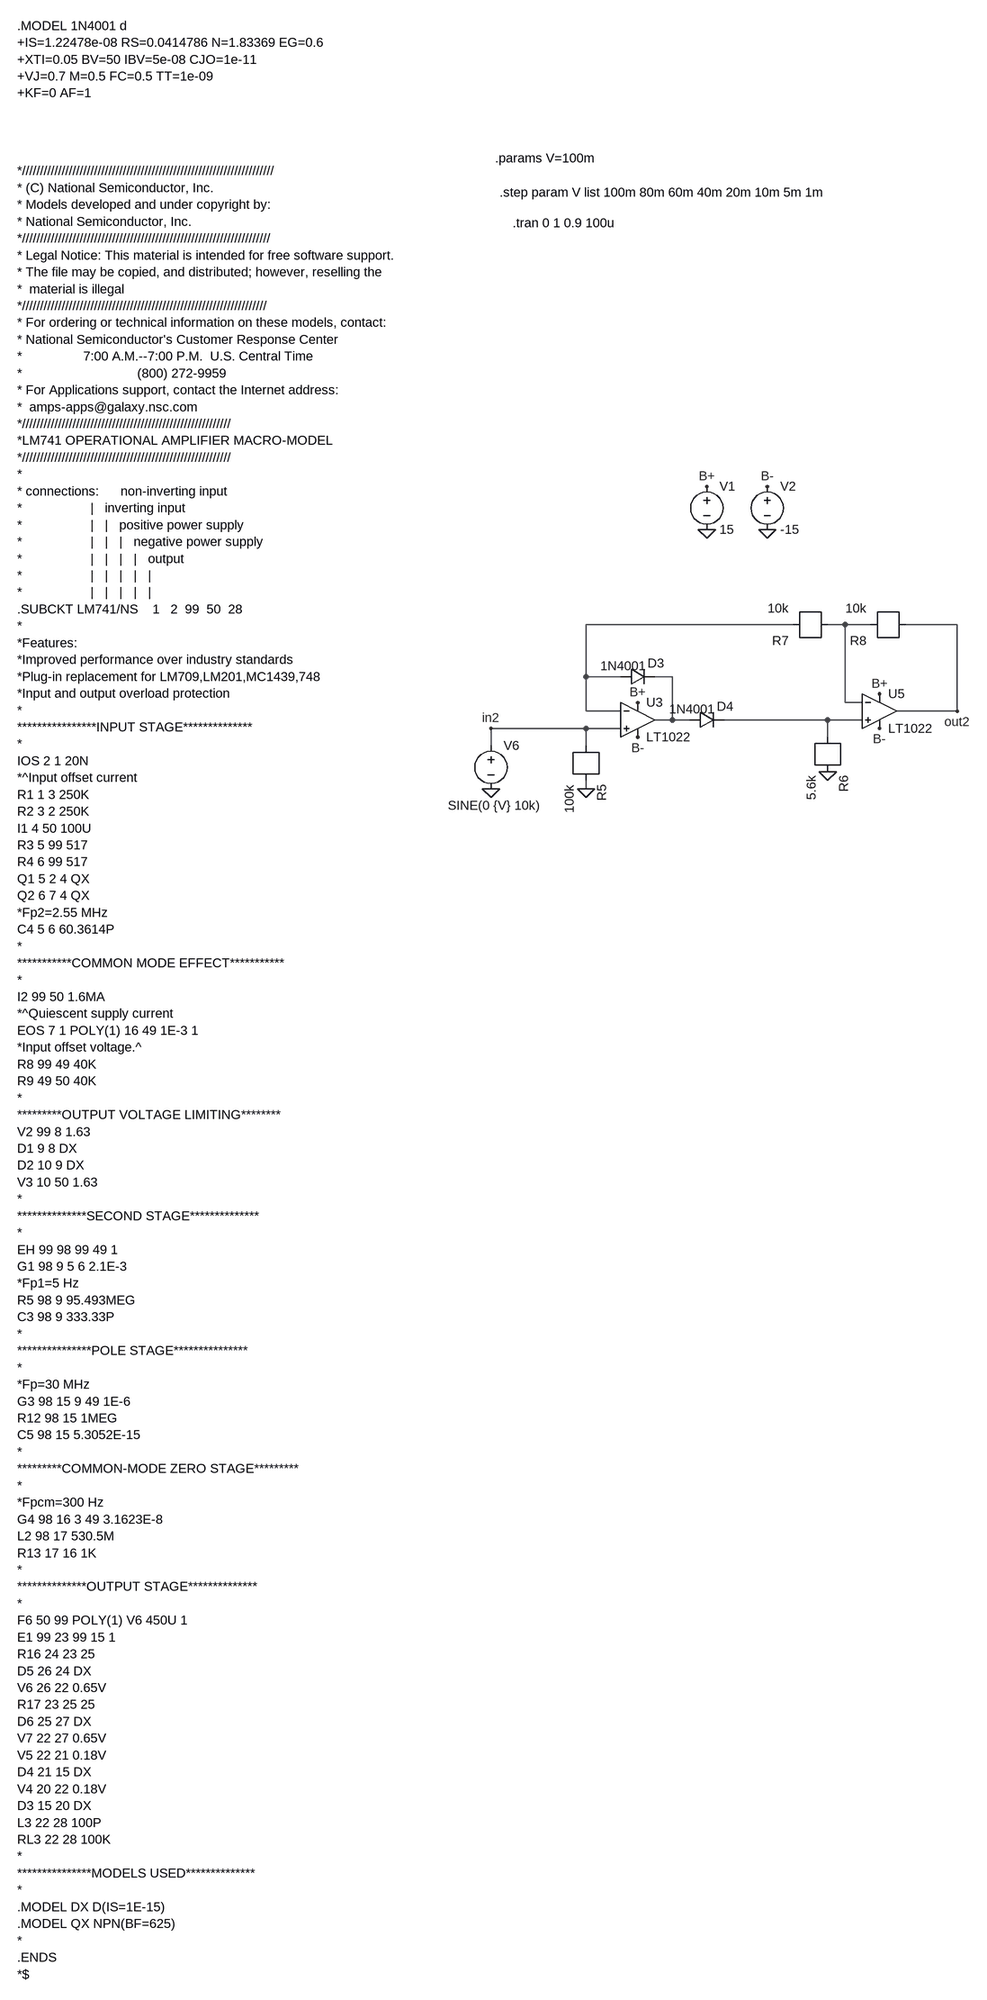
[diagram p0: schematic instru3.1.asc]
instru3.1.asc, the LTspice schematic file:
Version 4
SHEET 1 1272 2296
WIRE 480 768 96 768
WIRE 576 768 544 768
WIRE 624 768 576 768
WIRE 784 768 688 768
WIRE 96 864 96 768
WIRE 160 864 96 864
WIRE 256 864 224 864
WIRE 576 912 576 768
WIRE 608 912 576 912
WIRE 96 928 96 864
WIRE 160 928 96 928
WIRE 784 928 784 768
WIRE 784 928 672 928
WIRE 256 944 256 864
WIRE 256 944 224 944
WIRE 288 944 256 944
WIRE 544 944 352 944
WIRE 608 944 544 944
WIRE 96 960 -80 960
WIRE 160 960 96 960
WIRE 544 976 544 944
WIRE -80 992 -80 960
WIRE 96 992 96 960
WIRE 96 1072 96 1056
FLAG 432 592 0
FLAG 320 592 0
FLAG 320 512 B+
FLAG 432 512 B-
FLAG 544 1040 0
FLAG 192 912 B+
FLAG 640 896 B+
FLAG 640 960 B-
FLAG 192 976 B-
FLAG 784 928 out2
FLAG -80 960 in2
FLAG -80 1072 0
FLAG 96 1072 0
SYMBOL voltage 320 496 R0
SYMATTR InstName V1
SYMATTR Value 15
SYMBOL voltage 432 496 R0
SYMATTR InstName V2
SYMATTR Value -15
SYMBOL r 96 992 R90
SYMATTR InstName R5
SYMATTR Value 100k
SYMBOL r 544 976 R90
SYMATTR InstName R6
SYMATTR Value 5.6k
SYMBOL r 544 768 R180
SYMATTR InstName R7
SYMATTR Value 10k
SYMBOL r 688 768 R180
SYMATTR InstName R8
SYMATTR Value 10k
SYMBOL voltage -80 976 R0
WINDOW 3 -80 127 Left 2
SYMATTR Value SINE(0 {V} 10k)
SYMATTR InstName V6
SYMBOL diode 160 880 R270
WINDOW 0 25 66 VTop 2
WINDOW 3 51 5 VBottom 2
SYMATTR InstName D3
SYMATTR Value 1N4001
SYMBOL diode 288 960 R270
WINDOW 0 25 66 VTop 2
WINDOW 3 51 5 VBottom 2
SYMATTR InstName D4
SYMATTR Value 1N4001
SYMBOL opamps/LT1022 640 864 R0
SYMATTR InstName U5
SYMBOL opamps/LT1022 192 880 R0
SYMATTR InstName U3
TEXT -1848 -376 Left 2 !.MODEL 1N4001 d\n+IS=1.22478e-08 RS=0.0414786 N=1.83369 EG=0.6\n+XTI=0.05 BV=50 IBV=5e-08 CJO=1e-11\n+VJ=0.7 M=0.5 FC=0.5 TT=1e-09\n+KF=0 AF=1
TEXT -1848 -72 Left 2 !*//////////////////////////////////////////////////////////////////////\n* (C) National Semiconductor, Inc.\n* Models developed and under copyright by:\n* National Semiconductor, Inc.  \n*/////////////////////////////////////////////////////////////////////\n* Legal Notice: This material is intended for free software support.\n* The file may be copied, and distributed; however, reselling the \n*  material is illegal\n*////////////////////////////////////////////////////////////////////\n* For ordering or technical information on these models, contact:\n* National Semiconductor's Customer Response Center\n*                 7:00 A.M.--7:00 P.M.  U.S. Central Time\n*                                (800) 272-9959\n* For Applications support, contact the Internet address:\n*  amps-apps@galaxy.nsc.com\n*//////////////////////////////////////////////////////////\n*LM741 OPERATIONAL AMPLIFIER MACRO-MODEL\n*//////////////////////////////////////////////////////////\n*\n* connections:      non-inverting input\n*                   |   inverting input\n*                   |   |   positive power supply\n*                   |   |   |   negative power supply\n*                   |   |   |   |   output\n*                   |   |   |   |   |\n*                   |   |   |   |   |\n.SUBCKT LM741/NS    1   2  99  50  28\n*\n*Features:\n*Improved performance over industry standards\n*Plug-in replacement for LM709,LM201,MC1439,748\n*Input and output overload protection\n*\n****************INPUT STAGE**************\n*\nIOS 2 1 20N\n*^Input offset current\nR1 1 3 250K\nR2 3 2 250K\nI1 4 50 100U\nR3 5 99 517\nR4 6 99 517\nQ1 5 2 4 QX\nQ2 6 7 4 QX\n*Fp2=2.55 MHz\nC4 5 6 60.3614P\n*\n***********COMMON MODE EFFECT***********\n*\nI2 99 50 1.6MA\n*^Quiescent supply current\nEOS 7 1 POLY(1) 16 49 1E-3 1\n*Input offset voltage.^\nR8 99 49 40K\nR9 49 50 40K\n*\n*********OUTPUT VOLTAGE LIMITING********\nV2 99 8 1.63\nD1 9 8 DX\nD2 10 9 DX\nV3 10 50 1.63\n*\n**************SECOND STAGE**************\n*\nEH 99 98 99 49 1\nG1 98 9 5 6 2.1E-3\n*Fp1=5 Hz\nR5 98 9 95.493MEG\nC3 98 9 333.33P\n*\n***************POLE STAGE***************\n*\n*Fp=30 MHz\nG3 98 15 9 49 1E-6\nR12 98 15 1MEG\nC5 98 15 5.3052E-15\n*\n*********COMMON-MODE ZERO STAGE*********\n*\n*Fpcm=300 Hz\nG4 98 16 3 49 3.1623E-8\nL2 98 17 530.5M\nR13 17 16 1K\n*\n**************OUTPUT STAGE**************\n*\nF6 50 99 POLY(1) V6 450U 1\nE1 99 23 99 15 1\nR16 24 23 25\nD5 26 24 DX\nV6 26 22 0.65V\nR17 23 25 25\nD6 25 27 DX\nV7 22 27 0.65V\nV5 22 21 0.18V\nD4 21 15 DX\nV4 20 22 0.18V\nD3 15 20 DX\nL3 22 28 100P\nRL3 22 28 100K\n*\n***************MODELS USED**************\n*\n.MODEL DX D(IS=1E-15)\n.MODEL QX NPN(BF=625)\n*\n.ENDS\n*$
TEXT -40 24 Left 2 !.tran 0 1 0.9 100u
TEXT -64 -32 Left 2 !.step param V list 100m 80m 60m 40m 20m 10m 5m 1m
TEXT -72 -96 Left 2 !.params V=100m

The netlist it stands for:
* instru3.1.asc
V1 B+ 0 15
V2 B- 0 -15
R5 0 in2 100k
R6 0 N004 5.6k
R7 N001 N002 10k
R8 N002 out2 10k
V6 in2 0 SINE(0 {V} 10k)
D3 N001 N003 1N4001
D4 N003 N004 1N4001
XU5 N004 N002 B+ B- out2 LT1022  ; pins In+ In- V+ V- OUT
XU3 in2 N001 B+ B- N003 LT1022  ; pins In+ In- V+ V- OUT
.model D D
.lib standard.dio
.MODEL 1N4001 d
+IS=1.22478e-08 RS=0.0414786 N=1.83369 EG=0.6
+XTI=0.05 BV=50 IBV=5e-08 CJO=1e-11
+VJ=0.7 M=0.5 FC=0.5 TT=1e-09
+KF=0 AF=1
*//////////////////////////////////////////////////////////////////////
* (C) National Semiconductor, Inc.
* Models developed and under copyright by:
* National Semiconductor, Inc.
*/////////////////////////////////////////////////////////////////////
* Legal Notice: This material is intended for free software support.
* The file may be copied, and distributed; however, reselling the
*  material is illegal
*////////////////////////////////////////////////////////////////////
* For ordering or technical information on these models, contact:
* National Semiconductor's Customer Response Center
*                 7:00 A.M.--7:00 P.M.  U.S. Central Time
*                                (800) 272-9959
* For Applications support, contact the Internet address:
*  amps-apps@galaxy.nsc.com
*//////////////////////////////////////////////////////////
*LM741 OPERATIONAL AMPLIFIER MACRO-MODEL
*//////////////////////////////////////////////////////////
*
* connections:      non-inverting input
*                   |   inverting input
*                   |   |   positive power supply
*                   |   |   |   negative power supply
*                   |   |   |   |   output
*                   |   |   |   |   |
*                   |   |   |   |   |
.SUBCKT LM741/NS    1   2  99  50  28
*
*Features:
*Improved performance over industry standards
*Plug-in replacement for LM709,LM201,MC1439,748
*Input and output overload protection
*
****************INPUT STAGE**************
*
IOS 2 1 20N
*^Input offset current
R1 1 3 250K
R2 3 2 250K
I1 4 50 100U
R3 5 99 517
R4 6 99 517
Q1 5 2 4 QX
Q2 6 7 4 QX
*Fp2=2.55 MHz
C4 5 6 60.3614P
*
***********COMMON MODE EFFECT***********
*
I2 99 50 1.6MA
*^Quiescent supply current
EOS 7 1 POLY(1) 16 49 1E-3 1
*Input offset voltage.^
R8 99 49 40K
R9 49 50 40K
*
*********OUTPUT VOLTAGE LIMITING********
V2 99 8 1.63
D1 9 8 DX
D2 10 9 DX
V3 10 50 1.63
*
**************SECOND STAGE**************
*
EH 99 98 99 49 1
G1 98 9 5 6 2.1E-3
*Fp1=5 Hz
R5 98 9 95.493MEG
C3 98 9 333.33P
*
***************POLE STAGE***************
*
*Fp=30 MHz
G3 98 15 9 49 1E-6
R12 98 15 1MEG
C5 98 15 5.3052E-15
*
*********COMMON-MODE ZERO STAGE*********
*
*Fpcm=300 Hz
G4 98 16 3 49 3.1623E-8
L2 98 17 530.5M
R13 17 16 1K
*
**************OUTPUT STAGE**************
*
F6 50 99 POLY(1) V6 450U 1
E1 99 23 99 15 1
R16 24 23 25
D5 26 24 DX
V6 26 22 0.65V
R17 23 25 25
D6 25 27 DX
V7 22 27 0.65V
V5 22 21 0.18V
D4 21 15 DX
V4 20 22 0.18V
D3 15 20 DX
L3 22 28 100P
RL3 22 28 100K
*
***************MODELS USED**************
*
.MODEL DX D(IS=1E-15)
.MODEL QX NPN(BF=625)
*
.ENDS
*$
.tran 0 1 0.9 100u
.step param V list 100m 80m 60m 40m 20m 10m 5m 1m
.params V=100m
.backanno
.end